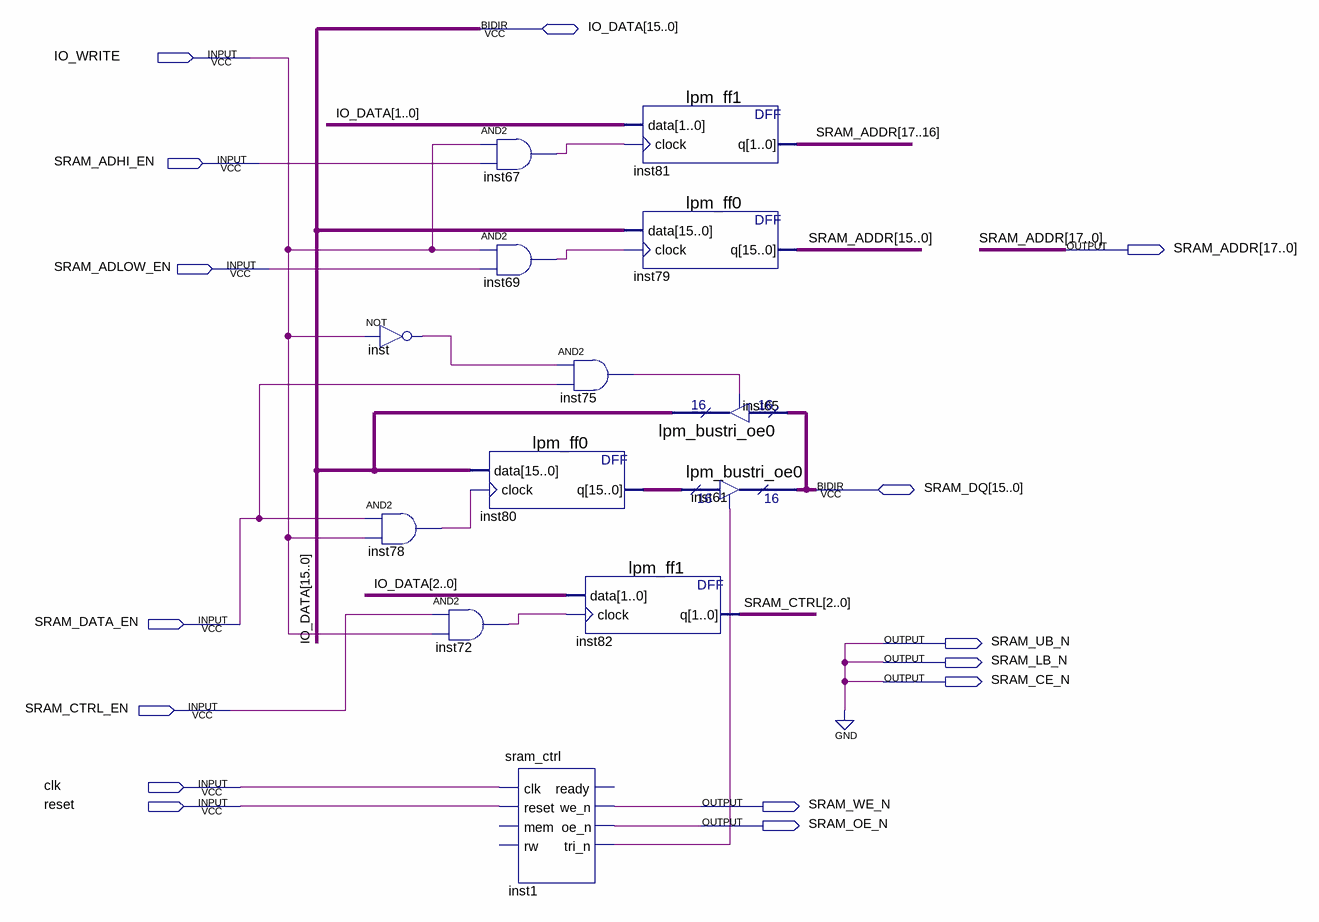
[diagram p0: schematic sheet]
// Quartus schematic SLOW_SRAM.bdf as structural Verilog: 13 symbols, 15 pins
module SLOW_SRAM (
  input  IO_WRITE,
  input  SRAM_ADHI_EN,
  input  SRAM_ADLOW_EN,
  input  SRAM_DATA_EN,
  input  SRAM_CTRL_EN,
  input  clk,
  input  reset,
  inout  [15:0] IO_DATA,
  inout  [15:0] SRAM_DQ,
  output [17:0] SRAM_ADDR,
  output SRAM_UB_N,
  output SRAM_LB_N,
  output SRAM_CE_N,
  output SRAM_WE_N,
  output SRAM_OE_N
);

  wire inst1_tri_n, inst67_out, inst69_out, inst72_out, inst75_out, inst78_out, inst_out;
  wire [2:0] SRAM_CTRL;
  wire [15:0] inst80_q;

  not inst (inst_out, IO_WRITE);
  and inst78 (inst78_out, SRAM_DATA_EN, IO_WRITE);
  and inst72 (inst72_out, SRAM_CTRL_EN, IO_WRITE);
  and inst67 (inst67_out, IO_WRITE, SRAM_ADHI_EN);
  and inst69 (inst69_out, IO_WRITE, SRAM_ADLOW_EN);
  lpm_ff0 inst80 (.data(IO_DATA), .clock(inst78_out), .q(inst80_q));
  sram_ctrl inst1 (
    .clk(clk), .reset(reset), .we_n(SRAM_WE_N), .oe_n(SRAM_OE_N), .tri_n(inst1_tri_n));  // open: mem, rw, ready
  and inst75 (inst75_out, inst_out, SRAM_DATA_EN);
  lpm_ff1 inst82 (.data(IO_DATA[2:0]), .clock(inst72_out), .q(SRAM_CTRL));
  lpm_ff1 inst81 (.data(IO_DATA[1:0]), .clock(inst67_out), .q(SRAM_ADDR[17:16]));
  lpm_ff0 inst79 (.data(IO_DATA), .clock(inst69_out), .q(SRAM_ADDR[15:0]));
  lpm_bustri_oe0 inst65 (.enabledt(inst75_out), .data(SRAM_DQ), .tridata(IO_DATA));
  lpm_bustri_oe0 inst61 (.enabledt(inst1_tri_n), .data(inst80_q), .tridata(SRAM_DQ));

  assign SRAM_CE_N = 1'b0;
  assign SRAM_LB_N = 1'b0;
  assign SRAM_UB_N = 1'b0;
endmodule
